# EAGLE schematic Easy_555_relay (EAGLE 6.5.0)
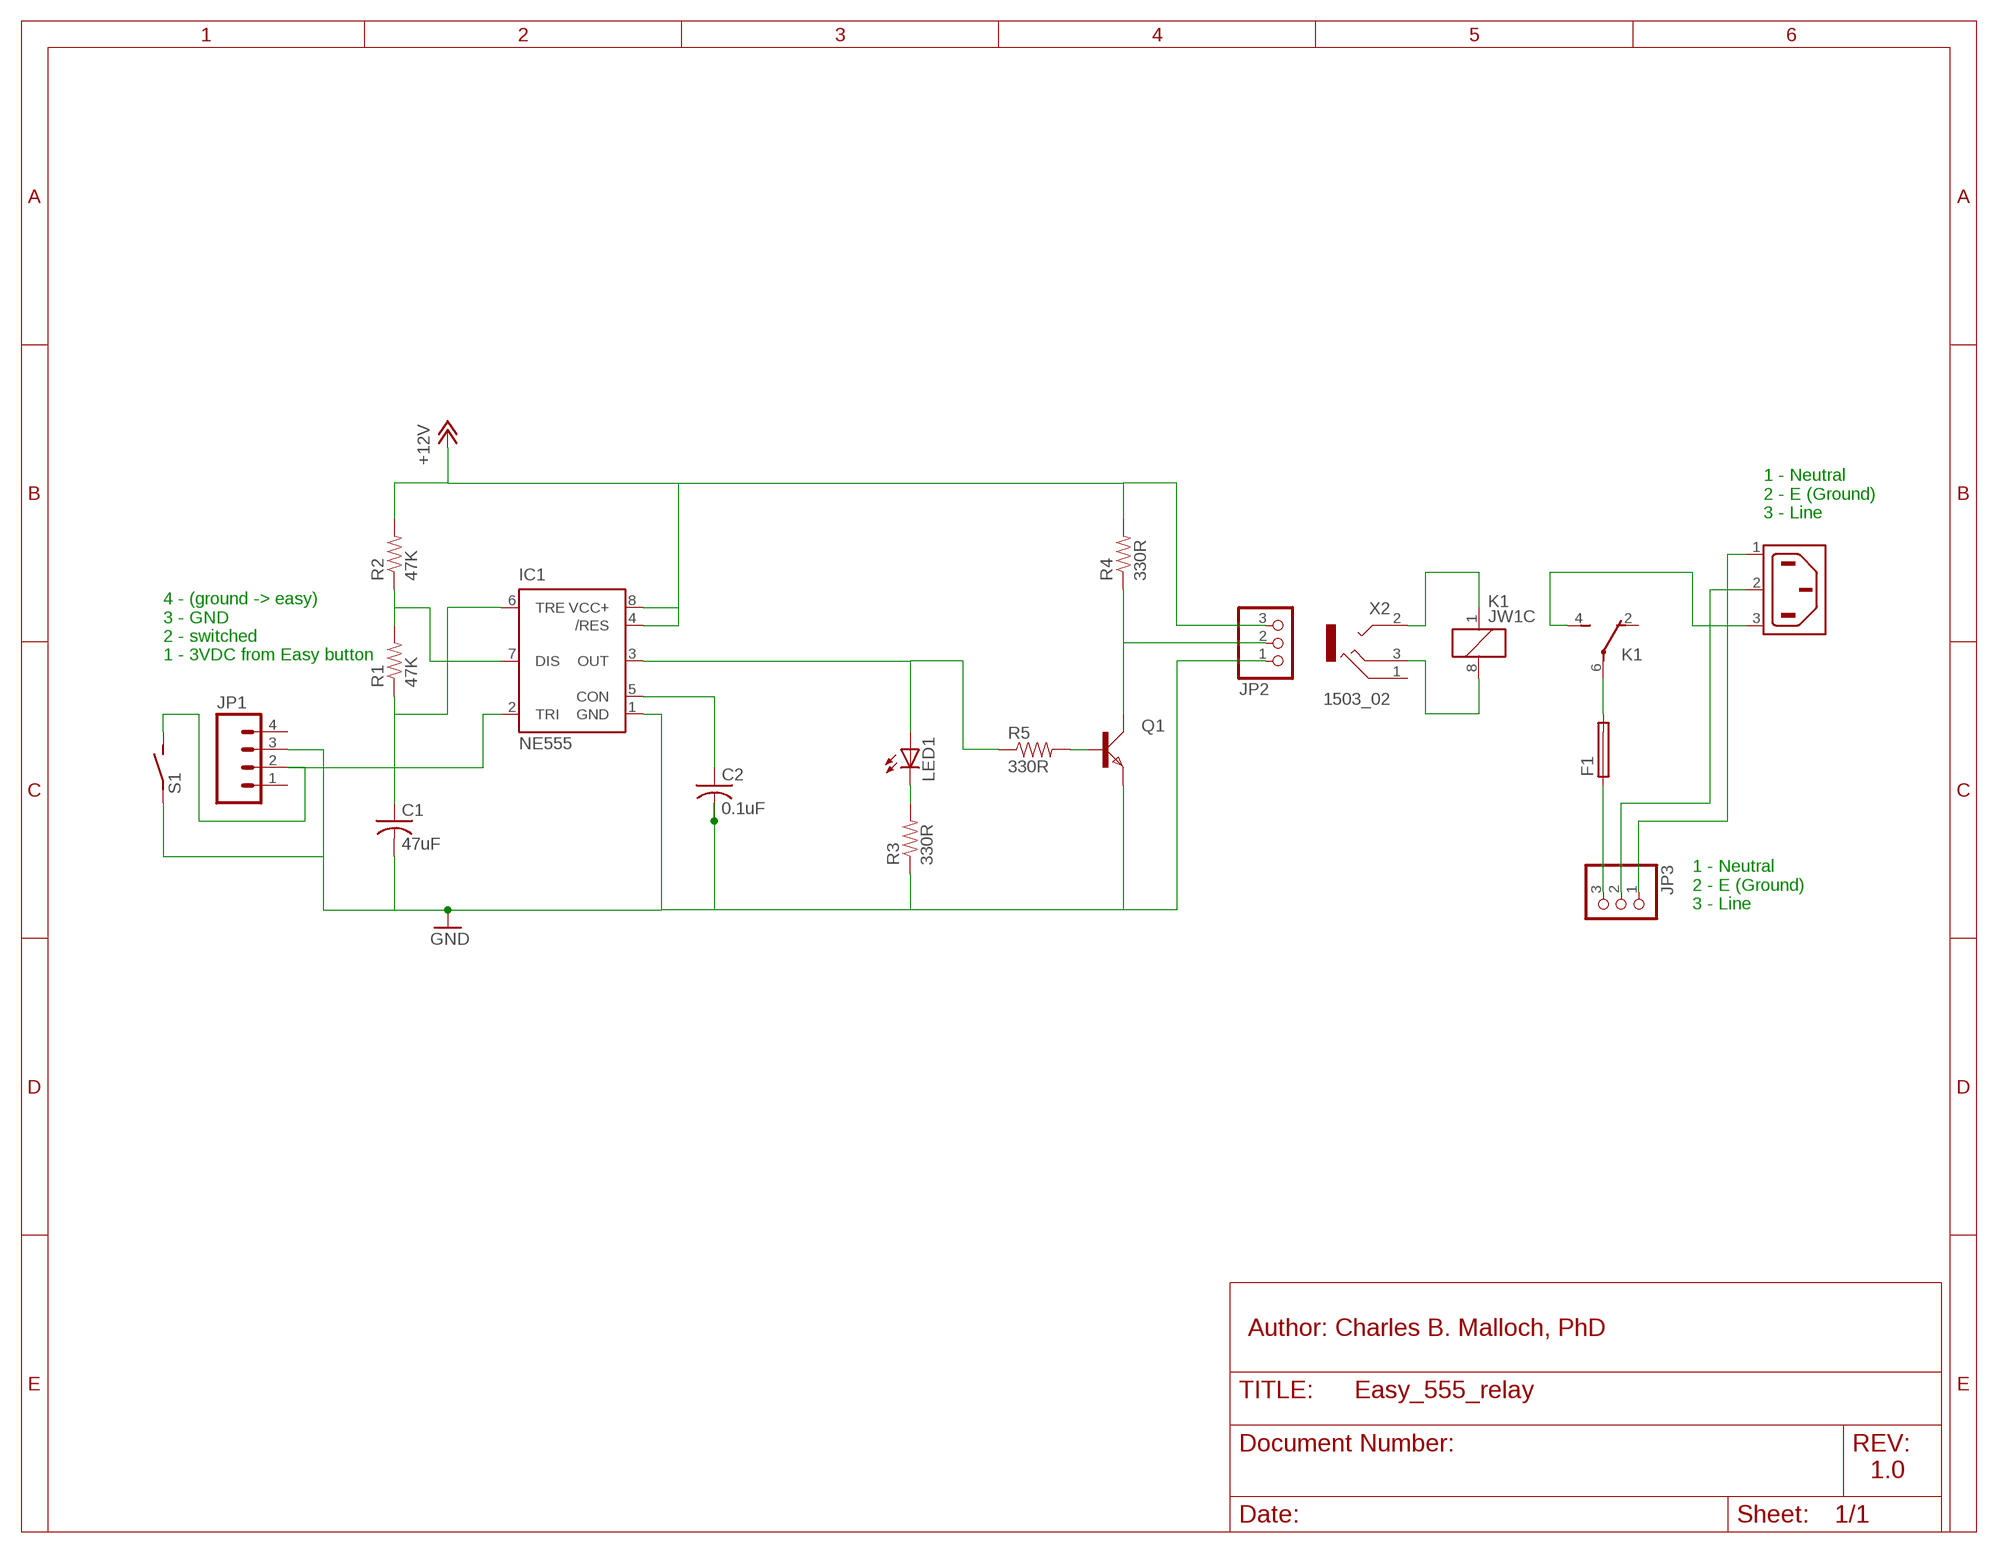
[diagram p0: schematic, sheet 1]

## Parts
C1  47uF  C-US050-030X075  [C050-030X075]
C2  0.1uF  C-US025-025X050  [C025-025X050]
F1  GSH15  [GSH15]
IC1  NE555  [DIL-08]
JP1  M04LOCK  [1X04_LOCK]
JP2  PINHD-1X3  [1X03]
JP3  PINHD-1X3  [1X03]
K1  JW1C  [JW1C]
LED1  LED3MM  [LED3MM]
Q1  2N3904-  [TO92D-]
R1  47K  RESISTORPTH-1/4W  [AXIAL-0.4]
R2  47K  RESISTORPTH-1/4W  [AXIAL-0.4]
R3  330R  RESISTORPTH-1/4W  [AXIAL-0.4]
R4  330R  RESISTORPTH-1/4W  [AXIAL-0.4]
R5  330R  RESISTORPTH-1/4W  [AXIAL-0.4]
S1  SPST2EVQPJ  [EVQPJ]
X1  6ESRM-P  [6ESRM-P]
X2  1503_02  [1503_02]

## Nets
+12V: IC1.4(/RES) IC1.8(VCC+) JP2.3 R2.P$2 R4.P$2
GND: C1.2 C2.2 IC1.1(GND) JP1.3 JP2.1 Q1.E R3.P$1 S1.A
N$1: IC1.7(DIS) R1.P$2 R2.P$1
N$2: C1.1 IC1.6(TRE) R1.P$1
N$3: K1.1 X2.2
N$4: K1.8 X2.3
N$5: Q1.C R4.P$1
N$6: F1.1 JP3.3
N$7: F1.2 K1.6(1:P)
N$8: IC1.2(TRI) JP1.2 S1.B
N$9: C2.1 IC1.5(CON)
N$10: K1.4(1:S) X1.3(AC2)
N$11: IC1.3(OUT) LED1.A R5.P$1
N$12: LED1.K(C) R3.P$2
N$13: JP3.2 X1.2(SH)
N$14: JP2.2
N$15: JP3.1 X1.1(AC1)
N$17: Q1.B R5.P$2
Unconnected: JP1.1 JP1.4 K1.2(1:O) X2.1 X2.2@2

## Notes on the sheet
- 1 - Neutral
  2 - E (Ground)
  3 - Line
- 4 - (ground -> easy)
  3 - GND
  2 - switched
  1 - 3VDC from Easy button
- 1 - Neutral
  2 - E (Ground)
  3 - Line
- Author: Charles B. Malloch, PhD
- 1.0

## Library data of the parts
C1 = resistor:C-US: CAPACITOR, American symbol
C2 = adafruit:C-US: CAPACITOR, American symbol
F1 = fuse:GSH15: FUSE HOLDER grid 15mm, 19649 Wickmann; MPN: 64900001039; OC_FARNELL: 1271673; OC_NEWARK: 02P0318
IC1 = st-microelectronics:NE555: General purpose bipolar Timer; MF: Arrow Electronics; MPN: NE555N; OC_FARNELL: 1467742; OC_NEWARK: 89K1486
JP1 = SparkFun-Connectors:M04: Header 4 Standard 4-pin 0.1" header. Use with straight break away headers (SKU : PRT-00116), right angle break away headers (PRT-00553), swiss pins (PRT-00743), machine pins (PRT-00117), and female headers (PRT-00115). Molex polarized connector foot print use with SKU : PRT-08231 with associated crimp pins and housings. 1MM SMD Version SKU: PRT-10208
JP2 JP3 = adafruit:PINHD-1X3: PIN HEADER
K1 = relay:JW1C: Power relay Source: Panasonic Electric Works Co., Ltd. / jw.catalog.pdf
LED1 = led:LED: LED OSRAM: - CHIPLED LG R971, LG N971, LY N971, LG Q971, LY Q971, LO R971, LY R971 LH N974, LH R974 LS Q976, LO Q976, LY Q976 LO Q996 - Hyper CHIPLED LW Q18S LB Q993, LB Q99A, LB R99A - SideLED LS A670, LO A670, LY A670, LG A670, LP A670 LB A673, LV A673, LT A673, LW A673 LH A674 LY A675 LS A676, LA A676, LO A676, LY A676, LW A676 LS A679, LY A679, LG A679 - Hyper Micro SIDELED® LS Y876, LA Y876, LO Y876, LY Y876 LT Y87S - SmartLED LW L88C, LW L88S LB L89C, LB L89S, LG L890 LS L89K, LO L89K, LY L89K LS L896, LA L896, LO L896, LY L896 - TOPLED LS T670, LO T670, LY T670, LG T670, LP T670 LSG T670, LSP T670, LSY T670, LOP T670, LYG T670 LG T671, LOG T671, LSG T671 LB T673, LV T673, LT T673, LW T673 LH T674 LS T676, LA T676, LO T676, LY T676, LB T676, LH T676, LSB T676, LW T676 LB T67C, LV T67C, LT T67C, LS T67K, LO T67K, LY T67K, LW E67C LS E67B, LA E67B, LO E67B, LY E67B, LB E67C, LV E67C, LT E67C LW T67C LS T679, LY T679, LG T679 LS T770, LO T770, LY T770, LG T770, LP T770 LB T773, LV T773, LT T773, LW T773 LH T774 LS E675, LA E675, LY E675, LS T675 LS T776, LA T776, LO T776, LY T776, LB T776 LHGB T686 LT T68C, LB T68C - Hyper Mini TOPLED® LB M676 - Mini TOPLED Santana® LG M470 LS M47K, LO M47K, LY M47K Source: http://www.osram.convergy.de LUXEON: - LUMILED® LXK2-PW12-R00, LXK2-PW12-S00, LXK2-PW14-U00, LXK2-PW14-V00 LXK2-PM12-R00, LXK2-PM12-S00, LXK2-PM14-U00 LXK2-PE12-Q00, LXK2-PE12-R00, LXK2-PE12-S00, LXK2-PE14-T00, LXK2-PE14-U00 LXK2-PB12-K00, LXK2-PB12-L00, LXK2-PB12-M00, LXK2-PB14-N00, LXK2-PB14-P00, LXK2-PB14-Q00 LXK2-PR12-L00, LXK2-PR12-M00, LXK2-PR14-Q00, LXK2-PR14-R00 LXK2-PD12-Q00, LXK2-PD12-R00, LXK2-PD12-S00 LXK2-PH12-R00, LXK2-PH12-S00 LXK2-PL12-P00, LXK2-PL12-Q00, LXK2-PL12-R00 Source: www.luxeon.com KINGBRIGHT: KA-3528ASYC Source: www.kingbright.com
Q1 = ads:2N3904-
R1-R5 = SparkFun-Passives:RESISTOR: Resistor Basic schematic elements and footprints for 0603, 1206, and PTH resistors.
S1 = ads4:SPST2: SPST Switch
X1 = con-tycoelectronics:6ESRM-P: AC Connector 120/250 VAC Source: http://catalog.tycoelectronics.com .. ENG_DS_1654001_1099_SR_0406.pdf; MF: TYCO ELECTRONICS; MPN: 6ESRM-P; OC_FARNELL: unknown; OC_NEWARK: 87F1821
X2 = con-lumberg:1503_02: Jack connectors according to JISC 6560, 3.5 mm Klinkeneinbaukupplung nach JISC 6560, 3,5 mm, 3-polig/stereo, abgewinkelte Ausführung, Surface-Mount-Technik (SMT) Source: http://www.lumberg.com/Produkte/PDFs/1503_02.pdf; OC_FARNELL: 1216979; OC_NEWARK: unknown